# Altium schematic sheet AUDIO.SchDoc
size A4
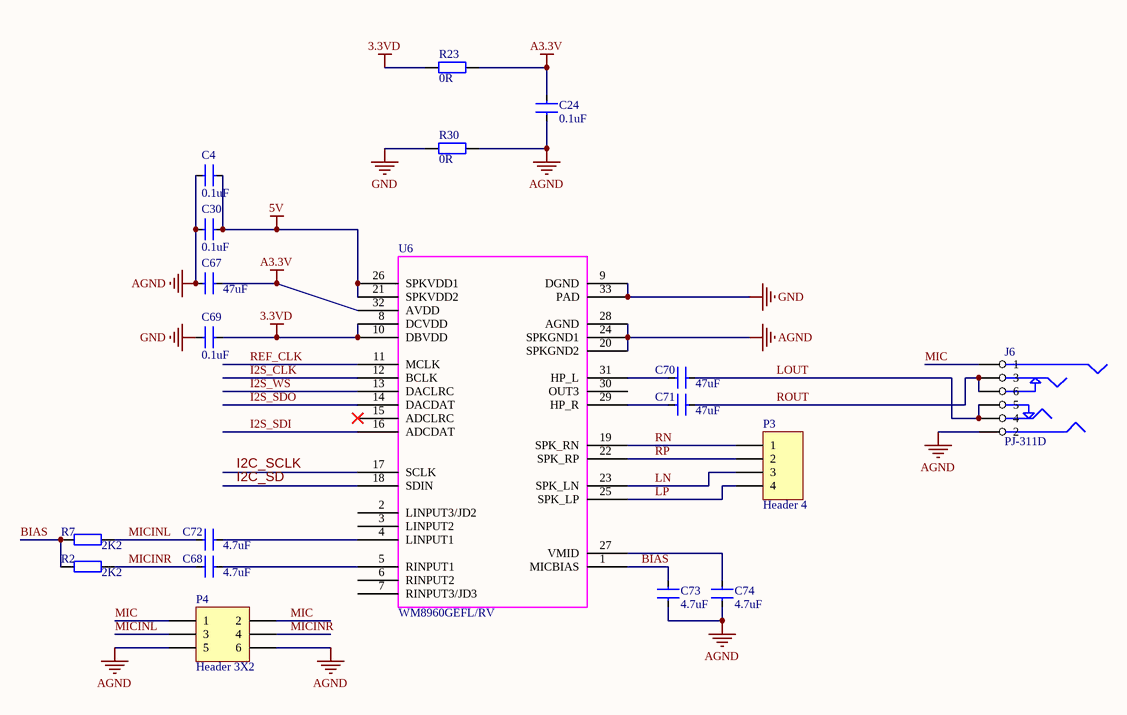
[diagram p0: AUDIO.SchDoc]

## Parts
C4  0.1uF  [C0402]
C24  0.1uF  [C0402]
C30  0.1uF  [C0402]
C67  47uF  [0805C]
C68  4.7uF  [C0402]
C69  0.1uF  [C0402]
C70  47uF  [0805C]
C71  47uF  [0805C]
C72  4.7uF  [C0402]
C73  4.7uF  [C0402]
C74  4.7uF  [C0402]
J6  PJ-311D  [PJ311D]
P3  Header 4  [HDR1X4 -2.0]
P4  Header 3X2  [HDR2X3 - 2.0]
R2  2K2  [R0402]
R7  2K2  [R0402]
R23  0R  [R0402]
R30  0R  [R0402]
U6  WM8960GEFL/RV  [QFN50P500X500X100-33N]

## Nets
3.3VD: C69.2 R23.1 U6.8(DCVDD) U6.10(DBVDD)
5V: C4.1 C30.1 U6.21(SPKVDD2) U6.26(SPKVDD1)
A3.3V: C24.2 C67.2 R23.2 U6.32(AVDD)
AGND: C4.2 C24.1 C30.2 C67.1 C73.1 C74.1 J6.2 P4.5 P4.6 R30.2 U6.20(SPKGND2) U6.24(SPKGND1) U6.28(AGND)
GND: C69.1 R30.1 U6.9(DGND) U6.33(PAD)
BIAS: C73.2 R2.1 R7.1 U6.1(MICBIAS)
I2C_SCLK: U6.17(SCLK)
I2C_SD: U6.18(SDIN)
I2S_CLK: U6.12(BCLK)
I2S_SDI: U6.16(ADCDAT)
I2S_SDO: U6.14(DACDAT)
I2S_WS: U6.13(DACLRC)
LN: P3.3 U6.23(SPK_LN)
LOUT: C70.1 J6.4 J6.5
LP: P3.4 U6.25(SPK_LP)
MIC: J6.1 P4.1 P4.2
MICINL: C72.2 P4.3 R7.2
MICINR: C68.2 P4.4 R2.2
REF_CLK: U6.11(MCLK)
RN: P3.1 U6.19(SPK_RN)
ROUT: C71.1 J6.3 J6.6
RP: P3.2 U6.22(SPK_RP)
NetC68_1: C68.1 U6.5(RINPUT1)
NetC70_2: C70.2 U6.31(HP_L)
NetC71_2: C71.2 U6.29(HP_R)
NetC72_1: C72.1 U6.4(LINPUT1)
NetC74_2: C74.2 U6.27(VMID)

Not connected (* = marked no-connect by the designer): U6 2(LINPUT3/JD2) 3(LINPUT2) 6(RINPUT2) 7(RINPUT3/JD3) 15(ADCLRC)* 30(OUT3)

## Library data of the parts
C4 C24 C30 C67-C74 = CAP: 普通小电容
P3 = Header 4: Header, 4-Pin; LatestRevisionDate: 17-Jul-2002; LatestRevisionNote: Re-released for DXP Platform.; Publisher: Altium Limited
P4 = Header 3X2: Header, 3-Pin, Dual row; LatestRevisionDate: 17-Jul-2002; LatestRevisionNote: Re-released for DXP Platform.; Publisher: Altium Limited
R2 R7 R23 R30 = RES: 普通电阻